# Altium project Full_Bridge_Converter.PrjPcb (part 2 of 2)

## Sheet Optic_PWM.SchDoc
size Letter; SheetNumber: 4; SheetTotal: 5
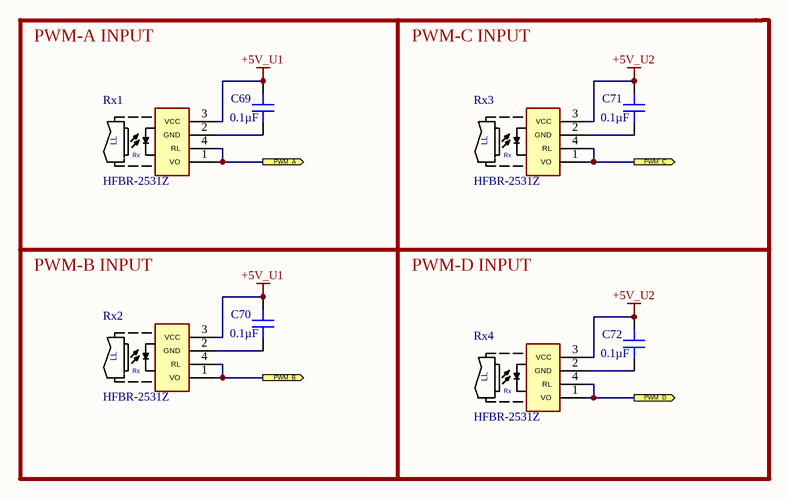
[diagram p4: Optic_PWM.SchDoc]

### Parts
C69  0.1µF  [CAP 0603_1608]
C70  0.1µF  [CAP 0603_1608]
C71  0.1µF  [CAP 0603_1608]
C72  0.1µF  [CAP 0603_1608]
Rx1  HFBR-2531Z  [HFBR-15X1V]
Rx2  HFBR-2531Z  [HFBR-15X1V]
Rx3  HFBR-2531Z  [HFBR-15X1V]
Rx4  HFBR-2531Z  [HFBR-15X1V]

### Ports
PWM_A (out), PWM_B (out), PWM_C (out), PWM_D (out)

### Nets
+5V_U1: C69.2 C70.2 Rx1.3(VCC) Rx2.3(VCC)
+5V_U2: C71.2 C72.2 Rx3.3(VCC) Rx4.3(VCC)
NetC69_1: C69.1 Rx1.2(GND)
NetC70_1: C70.1 Rx2.2(GND)
NetC71_1: C71.1 Rx3.2(GND)
NetC72_1: C72.1 Rx4.2(GND)
NetRx1_1: Rx1.1(VO) Rx1.4(RL) ; port PWM_A
NetRx2_1: Rx2.1(VO) Rx2.4(RL) ; port PWM_B
NetRx3_1: Rx3.1(VO) Rx3.4(RL) ; port PWM_C
NetRx4_1: Rx4.1(VO) Rx4.4(RL) ; port PWM_D

### Notes on the sheet
- PWM-A INPUT
- PWM-C INPUT
- PWM-B INPUT
- PWM-D INPUT
- (in symbol HFBR-2531Z) LL; Rx

### Library data of the parts
C69-C72 = C0603C104M5RACTU: CAP CER 0.1UF 50V X7R 0603; Manufacturer: KEMET; Tolerance: ±20%; Part Number: C0603C104M5RACTU; Value: 0.1µF; Applications: Bypass, Decoupling; Capacitance: 0.1µF; ComponentLink1Description: Datasheet; ComponentLink1URL: https://api.kemet.com/component-edge/download/datasheet/C0603C104M5RACTU.pdf; ComponentLink2Description: DigiKey Link; ComponentLink2URL: http://digikey.com/product-detail/en/kemet/C0603C104M5RACTU/399-7845-1-ND/3471568; Device Package: 0603 (1608 Metric); LastUpdated: 2/9/2020 01:03:01; Lifecycle Status: Active; Minimum Order: 1; Mounting Type: Surface Mount, MLCC; Operating Temperature: -55°C ~ 125°C; Package / Case: 0603 (1608 Metric); Packaging: TapeAndReel; PartId: 17854; Part Status: Active; Price: 0.01; Series: SMD Comm X7R; Size / Dimension: 0.063" L x 0.031" W (1.60mm x 0.80mm); Supplier 1: DigiKey; Supplier Part Number 1: 399-7845-1-ND; Temperature Coefficient: X7R; Thickness (Max): 0.034" (0.87mm); Voltage - Rated: 50V
Rx1-Rx4 = HFBR-2531Z: RX Optical Fiber 5MBd 6-Pin; Manufacturer: Broadcom Avago; Wavelength: 660nm; Operating Supply Current: 10mA; Max Supply Voltage: 7V; Min Supply Voltage: -500mV; Output Current: 25mA; Data Rate: 115Kbps; Operating Supply Voltage: 5V; Max Power Dissipation: 40mW; Rise Time: 80ns; Fall Time: 40ns; Supplier 1: Digi-Key; Supplier Part Number 1: 516-2067-ND; Manufacturer Part Number: HFBR-2531Z; RoHS: Yes; Category: Fiber Optics; Stock 1: 6696; Pricing 1: 1=12,98000, 10=9,79400, 100=8,22730, 500=7,55568, 1000=7,39200 (USD); Mount: Through Hole; Number of Pins: 6; Weight: 0.021164oz; Min Operating Temperature: -40°C; Max Operating Temperature: 85°C; Package Quantity: 200; Max Output Current: 25mA; Packaging: Rail/Tube; Series: HFBR-2; Length: 18.3mm; Width: 12.2mm; Height: 18.8mm; Radiation Hardening: No; REACH SVHC: No SVHC; Lead Free: Lead Free; RoHS Compliant: Yes

## Nets that join several sheets
+5V: NuevosGateDriver (7 pins), FLYBACK (6 pins)
GND: NuevosGateDriver (16 pins), FLYBACK (6 pins)
GND_G1: Power_Card (DZ2.2 Q1.3 R1.1 TP2.1), FLYBACK (TRACO1.5)
GND_G3: Power_Card (DZ6.2 Q3.3 R3.1 TP8.1), FLYBACK (TRACO3.5)
GND_G5: Power_Card (DZ11.2 Q5.3 R5.1 TP14.1), FLYBACK (TRACO5.5)
PGND: Power_Card (20 pins), FLYBACK (TRACO2.5 TRACO4.5 TRACO6.5)
NetCB_5_1: NuevosGateDriver (CB_5.1 GD2.8), FLYBACK (TRACO2.6)
NetCB_5_2: NuevosGateDriver (CB_5.2 GD2.5), FLYBACK (TRACO2.4)
NetCB_6_1: NuevosGateDriver (CB_6.1 GD1.8), FLYBACK (TRACO1.6)
NetCB_6_2: NuevosGateDriver (CB_6.2 GD1.5), FLYBACK (TRACO1.4)
NetDZ1_2: Power_Card (DZ1.2 Q1.4 R1.2 TP1.1), NuevosGateDriver (GR3.2)
NetDZ3_2: Power_Card (DZ3.2 Q2.4 R2.2 TP3.1), NuevosGateDriver (GR4.2)